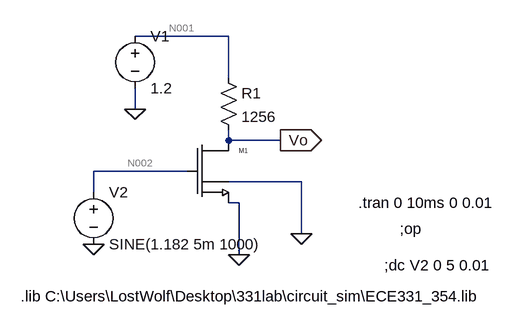
[diagram p0: schematic lab1_nmos 1.2V_sine.asc]
lab1_nmos 1.2V_sine.asc, the LTspice schematic file:
Version 4
SHEET 1 880 680
WIRE 176 -48 32 -48
WIRE 176 16 176 -48
WIRE 32 64 32 32
WIRE 176 112 176 96
WIRE 256 112 176 112
WIRE 112 160 -32 160
WIRE 288 176 176 176
WIRE -32 192 -32 160
WIRE 192 208 176 208
WIRE 288 256 288 176
WIRE 192 288 192 208
FLAG 192 288 0
FLAG 32 64 0
FLAG 288 256 0
FLAG -32 272 0
FLAG 256 112 Vo
IOPIN 256 112 Out
SYMBOL ALD1101 112 112 R0
SYMATTR InstName M1
SYMATTR SpiceModel ""
SYMATTR SpiceLine ""
SYMATTR Value ALD1101
SYMATTR Value2 W=1.379e-3 L=1E-6
SYMBOL res 160 0 R0
SYMATTR InstName R1
SYMATTR Value 1256
SYMBOL voltage 32 -64 R0
WINDOW 123 0 0 Left 2
WINDOW 39 0 0 Left 2
SYMATTR InstName V1
SYMATTR Value 1.2
SYMBOL voltage -32 176 R0
WINDOW 123 0 0 Left 2
WINDOW 39 0 0 Left 2
SYMATTR InstName V2
SYMATTR Value SINE(1.182 5m 1000)
TEXT -144 352 Left 2 !.lib C:\\Users\\LostWolf\\Desktop\\331lab\\circuit_sim\\ECE331_354.lib
TEXT 416 304 Left 2 !;dc V2 0 5 0.01
TEXT 440 248 Left 2 !;op
TEXT 376 208 Left 2 !.tran 0 10ms 0 0.01

The netlist it stands for:
* lab1_nmos 1.2V_sine.asc
M1 Vo N002 0 0 ALD1101 W=1.379e-3 L=1E-6
R1 N001 Vo 1256
V1 N001 0 1.2
V2 N002 0 SINE(1.182 5m 1000)
.model NMOS NMOS
.model PMOS PMOS
.lib standard.mos
.lib C:\Users\LostWolf\Desktop\331lab\circuit_sim\ECE331_354.lib
;dc V2 0 5 0.01
;op
.tran 0 10ms 0 0.01
.backanno
.end

* Results of the author's LTspice run, read from the files saved beside the schematic
* Operating Point, zero values left out:
*   V(vo) = 521.3 mV
*   V(n002) = 1.182 V
*   V(n001) = 1.2 V
*   Id(M1) = 540.4 µA
*   Is(M1) = -540.4 µA
*   I(R1) = 540.4 µA
*   I(V1) = -540.4 µA
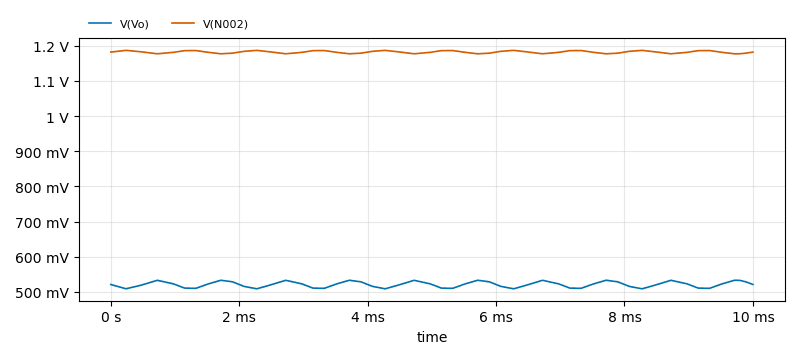
[diagram p1: Transient Analysis of lab1_nmos 1.2V_sine.asc, plotted from the saved traces]
* Transient Analysis, 1 run:
*   V(Vo): min 509.1 mV, max 533.3 mV, average 521.2 mV, rms 521.2 mV, last 521.3 mV
*   V(N002): min 1.177 V, max 1.187 V, average 1.182 V, rms 1.182 V, last 1.182 V